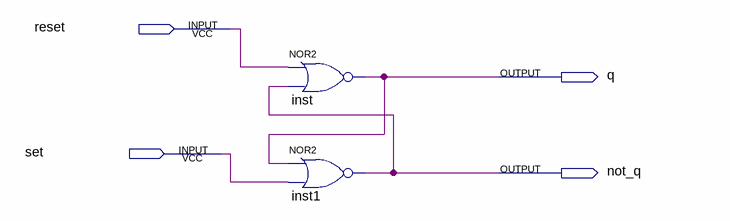
[diagram p0: schematic sheet]
// Quartus schematic rs_trigger.bdf as structural Verilog: 2 symbols, 4 pins
module rs_trigger (
  input  reset,
  input  set,
  output q,
  output not_q
);

  nor inst (q, reset, not_q);
  nor inst1 (not_q, q, set);
endmodule
